# Altium schematic sheet TraiTimMocKhoa.SchDoc
size A2
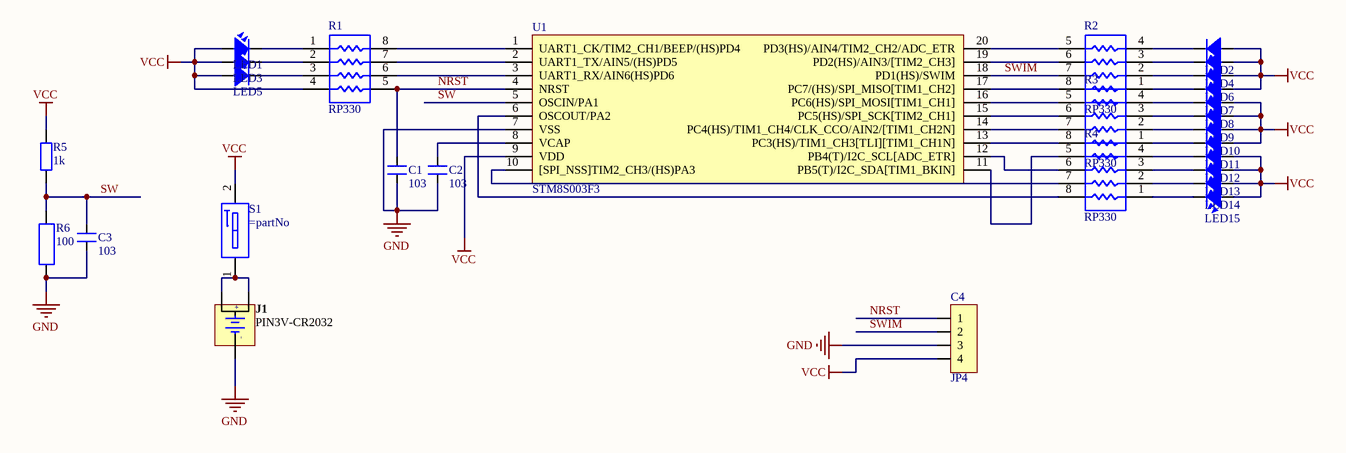
[diagram p0: TraiTimMocKhoa.SchDoc]

## Parts
C1  103  [SM-0805]
C2  103  [SM-0805]
C3  103  [SM-0805]
C4  JP4  [JP4-C1T]
J1  PIN3V-CR2032  [PIN3V - CR2032]
LED1  LED  [LED-0805-Green]  (value not drawn)
LED2  LED  [LED-0805-Green]  (value not drawn)
LED3  LED  [LED-0805-Green]  (value not drawn)
LED4  LED  [LED-0805-Green]  (value not drawn)
LED5  LED  [LED-0805-Green]  (value not drawn)
LED6  LED  [LED-0805-Green]  (value not drawn)
LED7  LED  [LED-0805-Green]  (value not drawn)
LED8  LED  [LED-0805-Green]  (value not drawn)
LED9  LED  [LED-0805-Green]  (value not drawn)
LED10  LED  [LED-0805-Green]  (value not drawn)
LED11  LED  [LED-0805-Green]  (value not drawn)
LED12  LED  [LED-0805-Green]  (value not drawn)
LED13  LED  [LED-0805-Green]  (value not drawn)
LED14  LED  [LED-0805-Green]  (value not drawn)
LED15  LED  [LED-0805-Green]  (value not drawn)
R1  RP330  [RESCAXS50P160X320X70-8N]
R2  RP330  [RESCAXS50P160X320X70-8N]
R3  RP330  [RESCAXS50P160X320X70-8N]
R4  RP330  [RESCAXS50P160X320X70-8N]
R5  1k  [SM-RES-0805]
R6  100  [RES-1W]
S1  (no value)  [SW-DIP1-1]
U1  STM8S003F3  [SSOP20]

## Nets
GND: C1.2 C2.2 C3.2 C4.3 J1.3 R6.2 U1.7(VSS)
VCC: C4.4 LED1.1 LED2.1 LED3.1 LED4.1 LED5.1 LED6.1 LED7.1 LED8.1 LED9.1 LED10.1 LED11.1 LED12.1 LED13.1 LED14.1 LED15.1 R1.4 R5.1 S1.2 U1.9(VDD)
NRST: C1.1 C4.1 R1.5 U1.4(NRST)
SW: C3.1 R5.2 R6.1 U1.5(OSCIN/PA1)
SWIM: C4.2 R2.7 U1.18(PD1(HS)/SWIM)
NetC2_1: C2.1 U1.8(VCAP)
NetJ1_1: J1.1 J1.2 S1.1
NetLED1_2: LED1.2 R1.1
NetLED2_2: LED2.2 R2.4
NetLED3_2: LED3.2 R1.2
NetLED4_2: LED4.2 R2.3
NetLED5_2: LED5.2 R1.3
NetLED6_2: LED6.2 R2.2
NetLED7_2: LED7.2 R2.1
NetLED8_2: LED8.2 R3.4
NetLED9_2: LED9.2 R3.3
NetLED10_2: LED10.2 R3.2
NetLED11_2: LED11.2 R3.1
NetLED12_2: LED12.2 R4.4
NetLED13_2: LED13.2 R4.3
NetLED14_2: LED14.2 R4.2
NetLED15_2: LED15.2 R4.1
NetR1_6: R1.6 U1.3(UART1_RX/AIN6(HS)PD6)
NetR1_7: R1.7 U1.2(UART1_TX/AIN5/(HS)PD5)
NetR1_8: R1.8 U1.1(UART1_CK/TIM2_CH1/BEEP/(HS)PD4)
NetR2_5: R2.5 U1.20(PD3(HS)/AIN4/TIM2_CH2/ADC_ETR)
NetR2_6: R2.6 U1.19(PD2(HS)/AIN3/[TIM2_CH3])
NetR2_8: R2.8 U1.17(PC7/(HS)/SPI_MISO[TIM1_CH2])
NetR3_5: R3.5 U1.16(PC6(HS)/SPI_MOSI[TIM1_CH1])
NetR3_6: R3.6 U1.15(PC5(HS)/SPI_SCK[TIM2_CH1])
NetR3_7: R3.7 U1.14(PC4(HS)/TIM1_CH4/CLK_CCO/AIN2/[TIM1_CH2N])
NetR3_8: R3.8 U1.13(PC3(HS)/TIM1_CH3[TLI][TIM1_CH1N])
NetR4_5: R4.5 U1.11(PB5(T)/I2C_SDA[TIM1_BKIN])
NetR4_6: R4.6 U1.12(PB4(T)/I2C_SCL[ADC_ETR])
NetR4_7: R4.7 U1.10([SPI_NSS]TIM2_CH3/(HS)PA3)
NetR4_8: R4.8 U1.6(OSCOUT/PA2)

## Notes on the sheet
- (in symbol PIN3V-CR2032) +; -

## Library data of the parts
C1-C3 = CM: Cap SMD; Value: 103
C4 = JP4: WR-PHD 2.54 mm Angled Socket Header; Manufacturer: W¨¹rth Elektronik eiSos GmbH; partNo: 613004143121; ComponentLink1 Description: Manufacturer; ComponentLink2 Description: Datasheet; NoPins: 04; Created Date: 29 March 2013; ComponentLink1URL: http://www.we-online.com; ComponentLink2URL: http://katalog.we-online.de/em/datasheet/6130xx143121.pdf; Created by: Karrer Zheng
J1 = PIN3V-CR2032: Coin Cell Holder, 21.08 x 15.24 mm SMD; Manufacturer: Memory Protection Devices; PartNumber: BK-912-TR; Battery Series: 2032; Battery Type, Function: Coin Cell, Retainer; Number of Cells: 1; ComponentLink2URL: http://www.memoryprotectiondevices.com/datasheets/BK-912-datasheet.pdf; ComponentLink3URL: http://www.memoryprotectiondevices.com/datasheets/BK-912-datasheet.pdf; ComponentLink3Description: Package Specification; ComponentLink1Description: Manufacturer URL; Family: Battery Holders, Clips, Contacts; ComponentLink1URL: http://www.memoryprotectiondevices.com/; Mounting Technology: Surface Mount; ComponentLink2Description: Datasheet; PackageReference: CN-DIN-3; PackageDescription: 3-Pin, CN-DIN, Body 21.08x15.24mm; Category: Battery Products
LED1-LED15 = LED SMD: Value: LED 3 - 5 ly 2 Colour
R1-R4 = ResPack
R5 = R1/4W: Resistor 1/4W; Value: R1/4W - 1K
R6 = R1W: Resistor 1W; Value: R1W - 100
S1 = SWDIP1: WS-DITV 2.54 mm small compact THT flat actuator with top tape; Manufacturer: Wurth Elektronik; Part No.: 418127160901; ComponentLink1 Description: Manufacturer; ComponentLink2 Description: Datasheet; Pole: 01; Created Date: Dec.2015; ComponentLink1URL: http://www.we-online.com; ComponentLink2URL: http://katalog.we-online.de/em/datasheet/4181271609xx.pdf; Created by: Baojun Chen